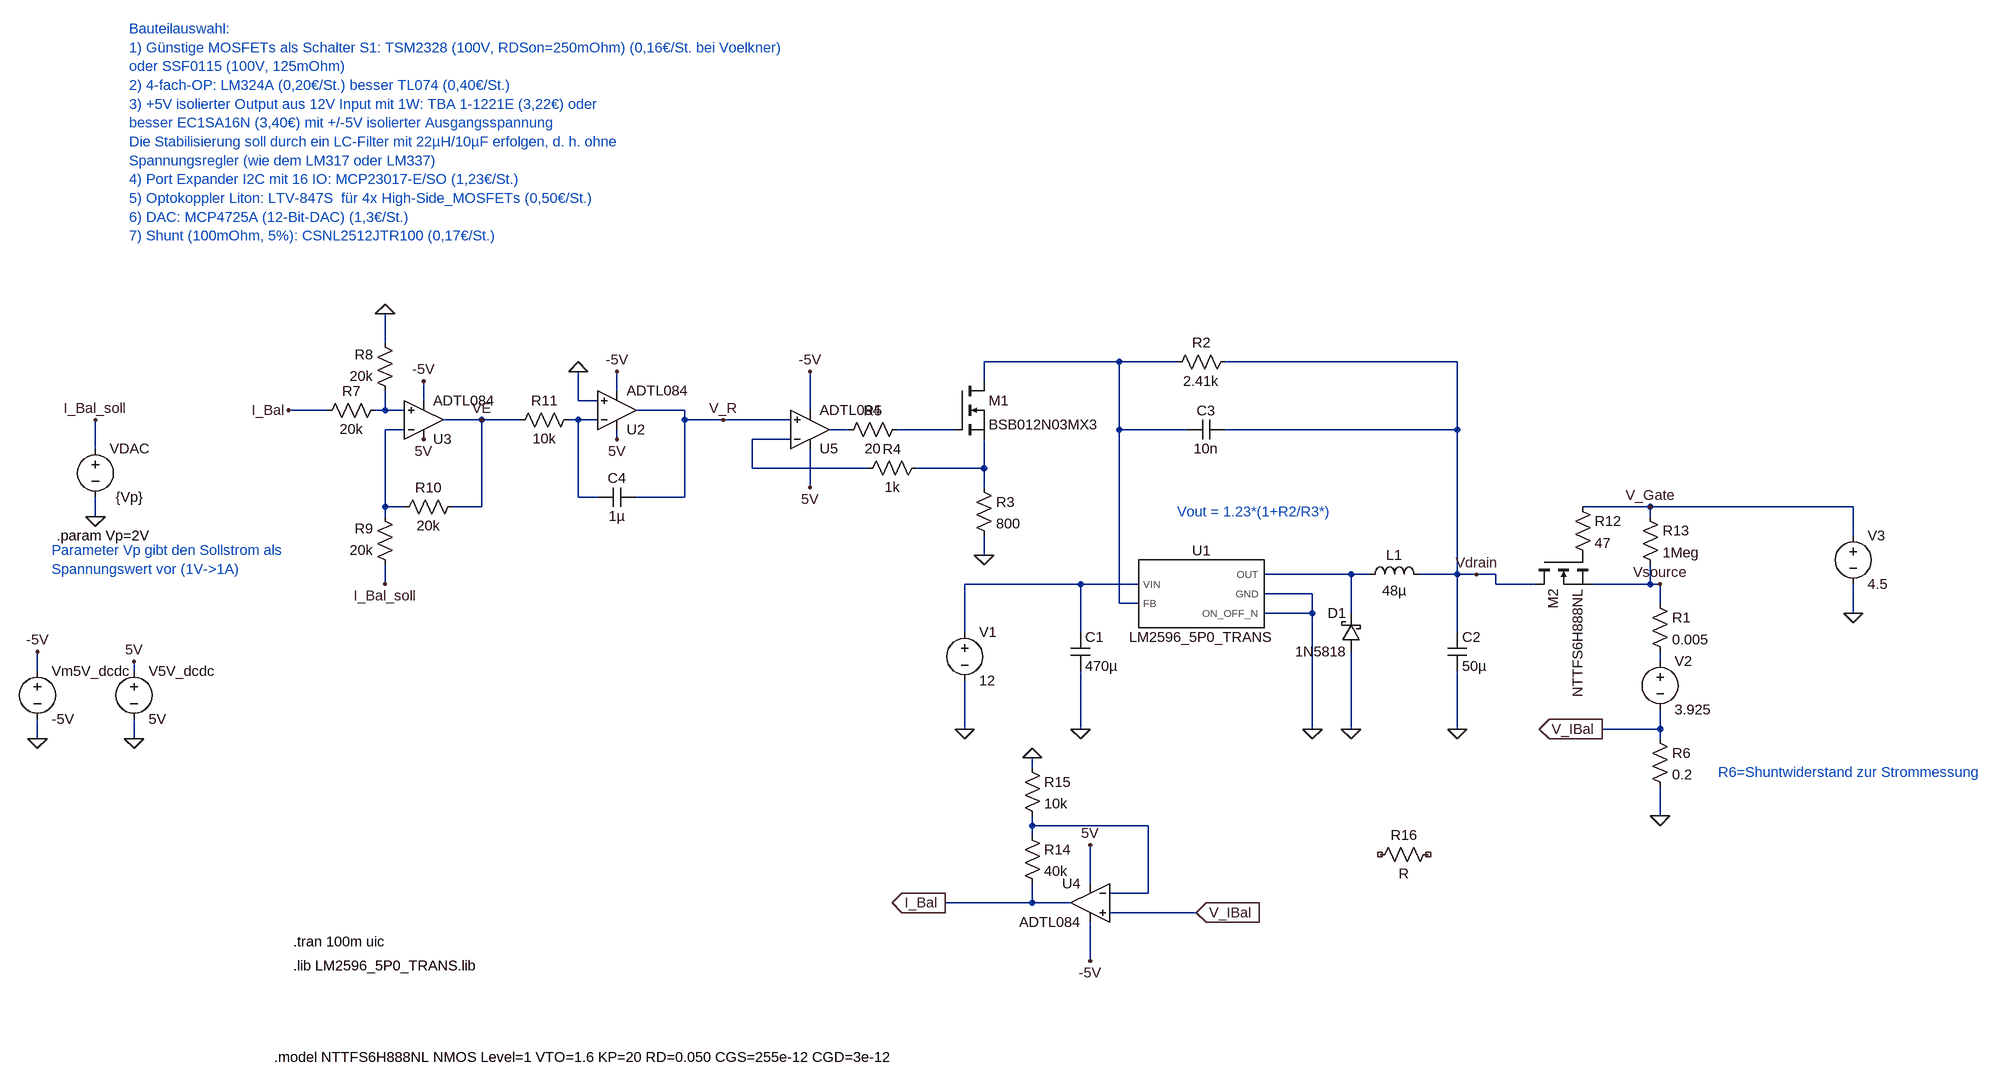
[diagram p0: schematic DCDC_Buck_Converter_I_control_mosfet_gegen schalter.asc]
DCDC_Buck_Converter_I_control_mosfet_gegen schalter.asc, the LTspice schematic file:
Version 4.1
SHEET 1 1992 1368
WIRE -1168 -272 -1168 -320
WIRE 48 -240 -176 -240
WIRE 144 -240 48 -240
WIRE 608 -240 224 -240
WIRE -176 -208 -176 -240
WIRE -784 -192 -784 -224
WIRE -1104 -176 -1104 -208
WIRE -848 -176 -848 -224
WIRE -816 -176 -848 -176
WIRE -1264 -160 -1328 -160
WIRE -1168 -160 -1168 -192
WIRE -1168 -160 -1184 -160
WIRE -1136 -160 -1168 -160
WIRE -672 -160 -752 -160
WIRE -464 -160 -464 -224
WIRE -1008 -144 -1072 -144
WIRE -944 -144 -1008 -144
WIRE -848 -144 -864 -144
WIRE -816 -144 -848 -144
WIRE -672 -144 -672 -160
WIRE -608 -144 -672 -144
WIRE -496 -144 -608 -144
WIRE -1136 -128 -1168 -128
WIRE -400 -128 -432 -128
WIRE -224 -128 -320 -128
WIRE 48 -128 48 -240
WIRE 160 -128 48 -128
WIRE 608 -128 608 -240
WIRE 608 -128 224 -128
WIRE -784 -112 -784 -128
WIRE -496 -112 -560 -112
WIRE -1648 -96 -1648 -144
WIRE -560 -64 -560 -112
WIRE -368 -64 -560 -64
WIRE -176 -64 -176 -112
WIRE -176 -64 -288 -64
WIRE -464 -32 -464 -96
WIRE -176 -32 -176 -64
WIRE -848 -16 -848 -144
WIRE -816 -16 -848 -16
WIRE -672 -16 -672 -144
WIRE -672 -16 -752 -16
WIRE -1168 0 -1168 -128
WIRE -1136 0 -1168 0
WIRE -1008 0 -1008 -144
WIRE -1008 0 -1056 0
WIRE 928 0 816 0
WIRE 1264 0 928 0
WIRE -1648 16 -1648 -16
WIRE -1168 16 -1168 0
WIRE 928 16 928 0
WIRE 1264 48 1264 0
WIRE -176 80 -176 48
WIRE 432 112 288 112
WIRE 464 112 432 112
WIRE 608 112 608 -128
WIRE 608 112 544 112
WIRE 640 112 608 112
WIRE 672 112 640 112
WIRE -1168 128 -1168 96
WIRE -16 128 -208 128
WIRE 80 128 -16 128
WIRE 672 128 672 112
WIRE 736 128 672 128
WIRE 928 128 928 96
WIRE 928 128 832 128
WIRE 944 128 928 128
WIRE 368 144 288 144
WIRE 48 160 48 -128
WIRE 80 160 48 160
WIRE 944 160 944 128
WIRE 368 176 368 144
WIRE 368 176 288 176
WIRE 432 176 432 112
WIRE 1264 176 1264 128
WIRE -208 208 -208 128
WIRE -16 208 -16 128
WIRE 608 208 608 112
WIRE 944 256 944 240
WIRE -1744 272 -1744 240
WIRE -1584 272 -1584 256
WIRE -208 368 -208 288
WIRE -16 368 -16 272
WIRE 368 368 368 176
WIRE 432 368 432 240
WIRE 608 368 608 272
WIRE 944 368 944 336
WIRE 944 368 848 368
WIRE -1744 384 -1744 352
WIRE -1584 384 -1584 352
WIRE 944 384 944 368
WIRE -96 432 -96 416
WIRE 944 512 944 464
WIRE -96 528 -96 512
WIRE 96 528 -96 528
WIRE -96 544 -96 528
WIRE 0 624 0 560
WIRE 96 640 96 528
WIRE 96 640 32 640
WIRE -96 656 -96 624
WIRE -96 656 -240 656
WIRE -32 656 -96 656
WIRE 176 672 32 672
WIRE 0 752 0 688
FLAG -208 368 0
FLAG -16 368 0
FLAG 368 368 0
FLAG 608 368 0
FLAG 944 512 0
FLAG -176 80 0
FLAG 432 368 0
FLAG -1648 16 0
FLAG -1584 384 0
FLAG -1648 -144 I_Bal_soll
FLAG 1264 176 0
FLAG 848 368 V_IBal
IOPIN 848 368 Out
FLAG -1584 256 5V
FLAG -464 -32 5V
FLAG -1168 -320 0
FLAG -1328 -160 I_Bal
FLAG -1104 -112 5V
FLAG -1744 384 0
FLAG -1744 240 -5V
FLAG -1104 -208 -5V
FLAG -784 -112 5V
FLAG -784 -224 -5V
FLAG -1168 128 I_Bal_soll
FLAG -1008 -144 VE
FLAG -608 -144 V_R
FLAG -848 -224 0
FLAG 944 128 Vsource
FLAG 640 112 Vdrain
FLAG 928 0 V_Gate
FLAG -464 -224 -5V
FLAG 0 560 5V
FLAG 0 752 -5V
FLAG 176 672 V_IBal
IOPIN 176 672 In
FLAG -240 656 I_Bal
IOPIN -240 656 Out
FLAG -96 416 0
SYMBOL voltage -208 192 R0
WINDOW 123 0 0 Left 0
WINDOW 39 0 0 Left 0
SYMATTR InstName V1
SYMATTR Value 12
SYMBOL cap -32 208 R0
SYMATTR InstName C1
SYMATTR Value 470µ
SYMBOL ind 448 128 R270
WINDOW 0 32 56 VTop 2
WINDOW 3 5 56 VBottom 2
SYMATTR InstName L1
SYMATTR Value 48µ
SYMATTR SpiceLine Rser=1m
SYMBOL cap 592 208 R0
SYMATTR InstName C2
SYMATTR Value 50µ
SYMBOL res 928 144 R0
SYMATTR InstName R1
SYMATTR Value 0.005
SYMBOL res 240 -256 R90
WINDOW 0 0 56 VBottom 2
WINDOW 3 32 56 VTop 2
SYMATTR InstName R2
SYMATTR Value 2.41k
SYMBOL res -192 -48 R0
SYMATTR InstName R3
SYMATTR Value 800
SYMBOL schottky 448 240 R180
WINDOW 0 24 64 Left 2
WINDOW 3 24 0 Left 2
SYMATTR InstName D1
SYMATTR Value 1N5818
SYMATTR Description Diode
SYMATTR Type diode
SYMBOL voltage 944 240 R0
WINDOW 123 0 0 Left 0
WINDOW 39 0 0 Left 0
SYMATTR InstName V2
SYMATTR Value 3.925
SYMBOL LM2596_5P0_TRANS 176 144 R0
SYMATTR InstName U1
SYMBOL nmos -224 -208 R0
SYMATTR InstName M1
SYMATTR Value BSB012N03MX3
SYMBOL voltage -1648 -112 R0
WINDOW 3 34 96 Left 2
WINDOW 123 0 0 Left 0
WINDOW 39 0 0 Left 0
SYMATTR Value {Vp}
SYMATTR InstName VDAC
SYMBOL voltage -1584 256 R0
WINDOW 123 0 0 Left 0
WINDOW 39 0 0 Left 0
SYMATTR InstName V5V_dcdc
SYMATTR Value 5V
SYMBOL res -384 -48 R270
WINDOW 0 32 56 VTop 2
WINDOW 3 0 56 VBottom 2
SYMATTR InstName R4
SYMATTR Value 1k
SYMBOL res -304 -144 R90
WINDOW 0 0 56 VBottom 2
WINDOW 3 32 56 VTop 2
SYMATTR InstName R5
SYMATTR Value 20
SYMBOL cap 224 -144 R90
WINDOW 0 0 32 VBottom 2
WINDOW 3 32 32 VTop 2
SYMATTR InstName C3
SYMATTR Value 10n
SYMBOL voltage 1264 32 R0
WINDOW 123 0 0 Left 0
WINDOW 39 0 0 Left 0
SYMATTR InstName V3
SYMATTR Value 4.5
SYMBOL res 928 368 R0
SYMATTR InstName R6
SYMATTR Value 0.2
SYMBOL res -1168 -176 R90
WINDOW 0 0 56 VBottom 2
WINDOW 3 32 56 VTop 2
SYMATTR InstName R7
SYMATTR Value 20k
SYMBOL res -1152 -176 R180
WINDOW 0 36 76 Left 2
WINDOW 3 36 40 Left 2
SYMATTR InstName R8
SYMATTR Value 20k
SYMBOL res -1152 112 R180
WINDOW 0 36 76 Left 2
WINDOW 3 36 40 Left 2
SYMATTR InstName R9
SYMATTR Value 20k
SYMBOL res -1152 16 R270
WINDOW 0 32 56 VTop 2
WINDOW 3 0 56 VBottom 2
SYMATTR InstName R10
SYMATTR Value 20k
SYMBOL voltage -1744 256 R0
WINDOW 123 0 0 Left 0
WINDOW 39 0 0 Left 0
SYMATTR InstName Vm5V_dcdc
SYMATTR Value -5V
SYMBOL cap -752 -32 R90
WINDOW 0 0 32 VBottom 2
WINDOW 3 32 32 VTop 2
SYMATTR InstName C4
SYMATTR Value 1µ
SYMBOL res -848 -160 R90
WINDOW 0 0 56 VBottom 2
WINDOW 3 32 56 VTop 2
SYMATTR InstName R11
SYMATTR Value 10k
SYMBOL OpAmps\\ADTL084 -464 -64 M180
SYMATTR InstName U5
SYMBOL OpAmps\\ADTL084 -784 -96 M180
SYMATTR InstName U2
SYMBOL OpAmps\\ADTL084 -1104 -80 M180
SYMATTR InstName U3
SYMBOL nmos 736 80 M90
SYMATTR InstName M2
SYMATTR Value NTTFS6H888NL
SYMBOL res 800 -16 R0
SYMATTR InstName R12
SYMATTR Value 47
SYMBOL res 912 0 R0
SYMATTR InstName R13
SYMATTR Value 1Meg
SYMBOL OpAmps\\ADTL084 0 592 M0
SYMATTR InstName U4
SYMBOL res -112 528 R0
SYMATTR InstName R14
SYMATTR Value 40k
SYMBOL res -112 416 R0
SYMATTR InstName R15
SYMATTR Value 10k
SYMBOL res 576 560 R90
WINDOW 0 0 56 VBottom 2
WINDOW 3 32 56 VTop 2
SYMATTR InstName R16
TEXT -1320 760 Left 2 !.lib LM2596_5P0_TRANS.lib
TEXT -1320 720 Left 2 !.tran 100m uic
TEXT 144 8 Left 2 ;Vout = 1.23*(1+R2/R3*)
TEXT -1712 48 Left 2 !.param Vp=2V
TEXT -1592 -792 Left 2 ;Bauteilauswahl:\n1) Günstige MOSFETs als Schalter S1: TSM2328 (100V, RDSon=250mOhm) (0,16€/St. bei Voelkner)\noder SSF0115 (100V, 125mOhm)\n2) 4-fach-OP: LM324A (0,20€/St.) besser TL074 (0,40€/St.)\n3) +5V isolierter Output aus 12V Input mit 1W: TBA 1-1221E (3,22€) oder \nbesser EC1SA16N (3,40€) mit +/-5V isolierter Ausgangsspannung\nDie Stabilisierung soll durch ein LC-Filter mit 22µH/10µF erfolgen, d. h. ohne \nSpannungsregler (wie dem LM317 oder LM337) \n4) Port Expander I2C mit 16 IO: MCP23017-E/SO (1,23€/St.)\n5) Optokoppler Liton: LTV-847S  für 4x High-Side_MOSFETs (0,50€/St.)\n6) DAC: MCP4725A (12-Bit-DAC) (1,3€/St.)\n7) Shunt (100mOhm, 5%): CSNL2512JTR100 (0,17€/St.)
TEXT -1720 72 Left 2 ;Parameter Vp gibt den Sollstrom als \nSpannungswert vor (1V->1A)
TEXT 1040 440 Left 2 ;R6=Shuntwiderstand zur Strommessung
TEXT -1352 912 Left 2 !.model NTTFS6H888NL NMOS Level=1 VTO=1.6 KP=20 RD=0.050 CGS=255e-12 CGD=3e-12

The netlist it stands for:
* DCDC_Buck_Converter_I_control_mosfet_gegen schalter.asc
V1 N010 0 12
C1 N010 0 470µ
L1 N009 Vdrain 48µ Rser=1m
C2 Vdrain 0 50µ
R1 Vsource N011 0.005
R2 Vdrain N001 2.41k
R3 N008 0 800
D1 0 N009 1N5818
V2 N011 V_IBal 3.925
X§U1 N010 N001 N009 0 0 LM2596_5P0_TRANS  ; pins VIN FB OUT GND ON_OFF_N
M1 N001 N006 N008 N008 BSB012N03MX3
VDAC I_Bal_soll 0 {Vp}
V5V_dcdc 5V 0 5V
R4 N007 N008 1k
R5 N006 N005 20
C3 Vdrain N001 10n
V3 V_Gate 0 4.5
R6 V_IBal 0 0.2
R7 N002 I_Bal 20k
R8 N002 0 20k
R9 I_Bal_soll N004 20k
R10 N004 VE 20k
Vm5V_dcdc -5V 0 -5V
C4 V_R N003 1µ
R11 N003 VE 10k
X§U5 V_R N007 5V -5V N005 ADTL084  ; pins In+ In- V+ V- OUT
X§U2 0 N003 5V -5V V_R ADTL084  ; pins In+ In- V+ V- OUT
X§U3 N002 N004 5V -5V VE ADTL084  ; pins In+ In- V+ V- OUT
M2 Vdrain P001 Vsource Vsource NTTFS6H888NL
R12 V_Gate P001 47
R13 V_Gate Vsource 1Meg
X§U4 V_IBal N012 5V -5V I_Bal ADTL084  ; pins In+ In- V+ V- OUT
R14 N012 I_Bal 40k
R15 0 N012 10k
R16 NC_01 NC_02 R
.model D D
.lib standard.dio
.model NMOS NMOS
.model PMOS PMOS
.lib standard.mos
.lib LM2596_5P0_TRANS.lib
.tran 100m uic
* Vout = 1.23*(1+R2/R3*)
.param Vp=2V
* Bauteilauswahl:
* 1) Günstige MOSFETs als Schalter S1: TSM2328 (100V, RDSon=250mOhm) (0,16€/St. bei Voelkner)
* oder SSF0115 (100V, 125mOhm)
* 2) 4-fach-OP: LM324A (0,20€/St.) besser TL074 (0,40€/St.)
* 3) +5V isolierter Output aus 12V Input mit 1W: TBA 1-1221E (3,22€) oder
* besser EC1SA16N (3,40€) mit +/-5V isolierter Ausgangsspannung
* Die Stabilisierung soll durch ein LC-Filter mit 22µH/10µF erfolgen, d. h. ohne
* Spannungsregler (wie dem LM317 oder LM337)
* 4) Port Expander I2C mit 16 IO: MCP23017-E/SO (1,23€/St.)
* 5) Optokoppler Liton: LTV-847S  für 4x High-Side_MOSFETs (0,50€/St.)
* 6) DAC: MCP4725A (12-Bit-DAC) (1,3€/St.)
* 7) Shunt (100mOhm, 5%): CSNL2512JTR100 (0,17€/St.)
* Parameter Vp gibt den Sollstrom als
* Spannungswert vor (1V->1A)
* R6=Shuntwiderstand zur Strommessung
.model NTTFS6H888NL NMOS Level=1 VTO=1.6 KP=20 RD=0.050 CGS=255e-12 CGD=3e-12
.lib ADTL084.lib
.backanno
.end